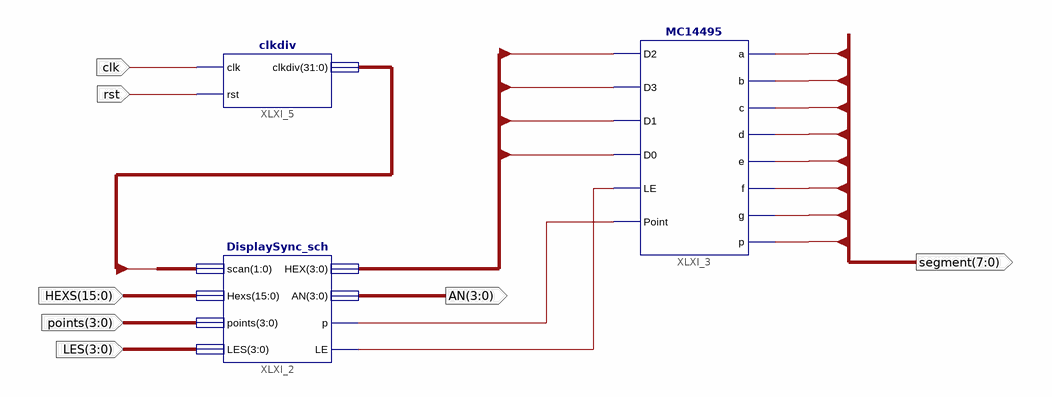
[diagram p0: schematic sheet 1]
// Xilinx ISE schematic disp_num.sch (artix7) as structural Verilog: 3 symbols, 7 ports
module disp_num (
  input  rst,
  input  [15:0] HEXS,
  input  [3:0] points,
  input  [3:0] LES,
  input  clk,
  output [3:0] AN,
  output [7:0] segment
);

  wire XLXN_10, XLXN_11;
  wire [3:0] HEX;
  wire [31:0] clkdiv;

  DisplaySync_sch XLXI_2 (
    .scan(clkdiv[18:17]), .Hexs(HEXS), .points(points), .LES(LES), .HEX(HEX), .p(XLXN_10), .LE(XLXN_11),
    .AN(AN));
  MC14495 XLXI_3 (
    .D2(HEX[2]), .D3(HEX[3]), .D1(HEX[1]), .D0(HEX[0]), .LE(XLXN_11), .Point(XLXN_10), .a(segment[0]),
    .b(segment[1]), .c(segment[2]), .d(segment[3]), .e(segment[4]), .f(segment[5]), .g(segment[6]),
    .p(segment[7]));
  clkdiv XLXI_5 (.clk(clk), .rst(rst), .clkdiv(clkdiv));
endmodule
